# EAGLE board cbm2ram (EAGLE 7.7.0), part 1 of 2
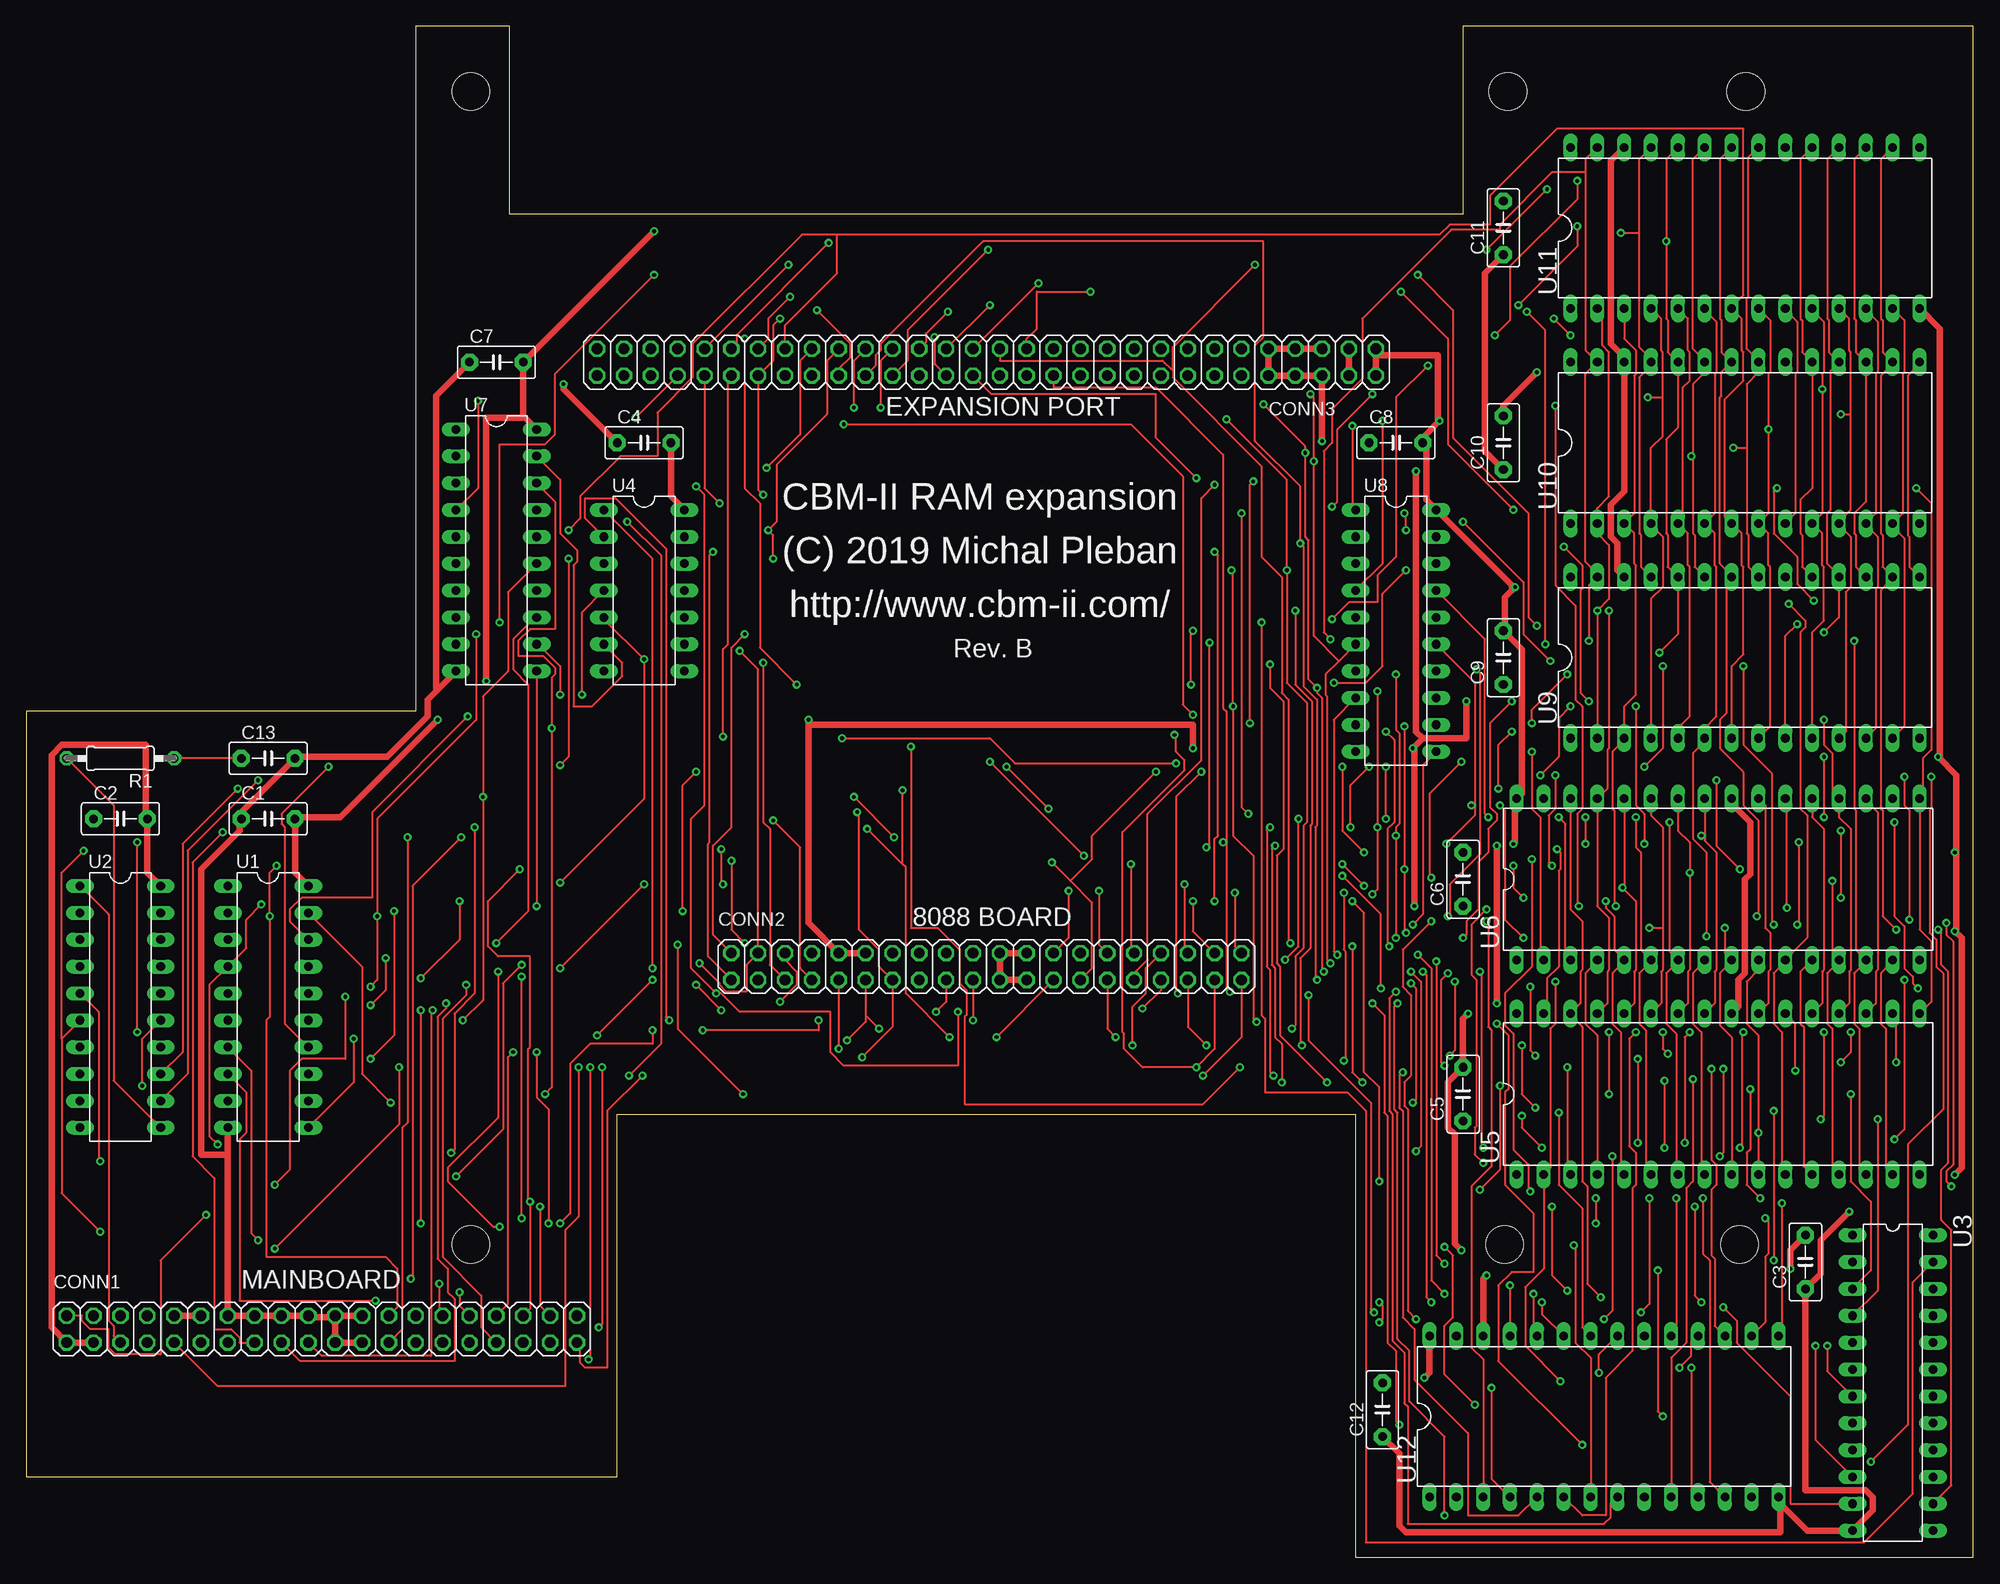
[diagram p1: board, top side]
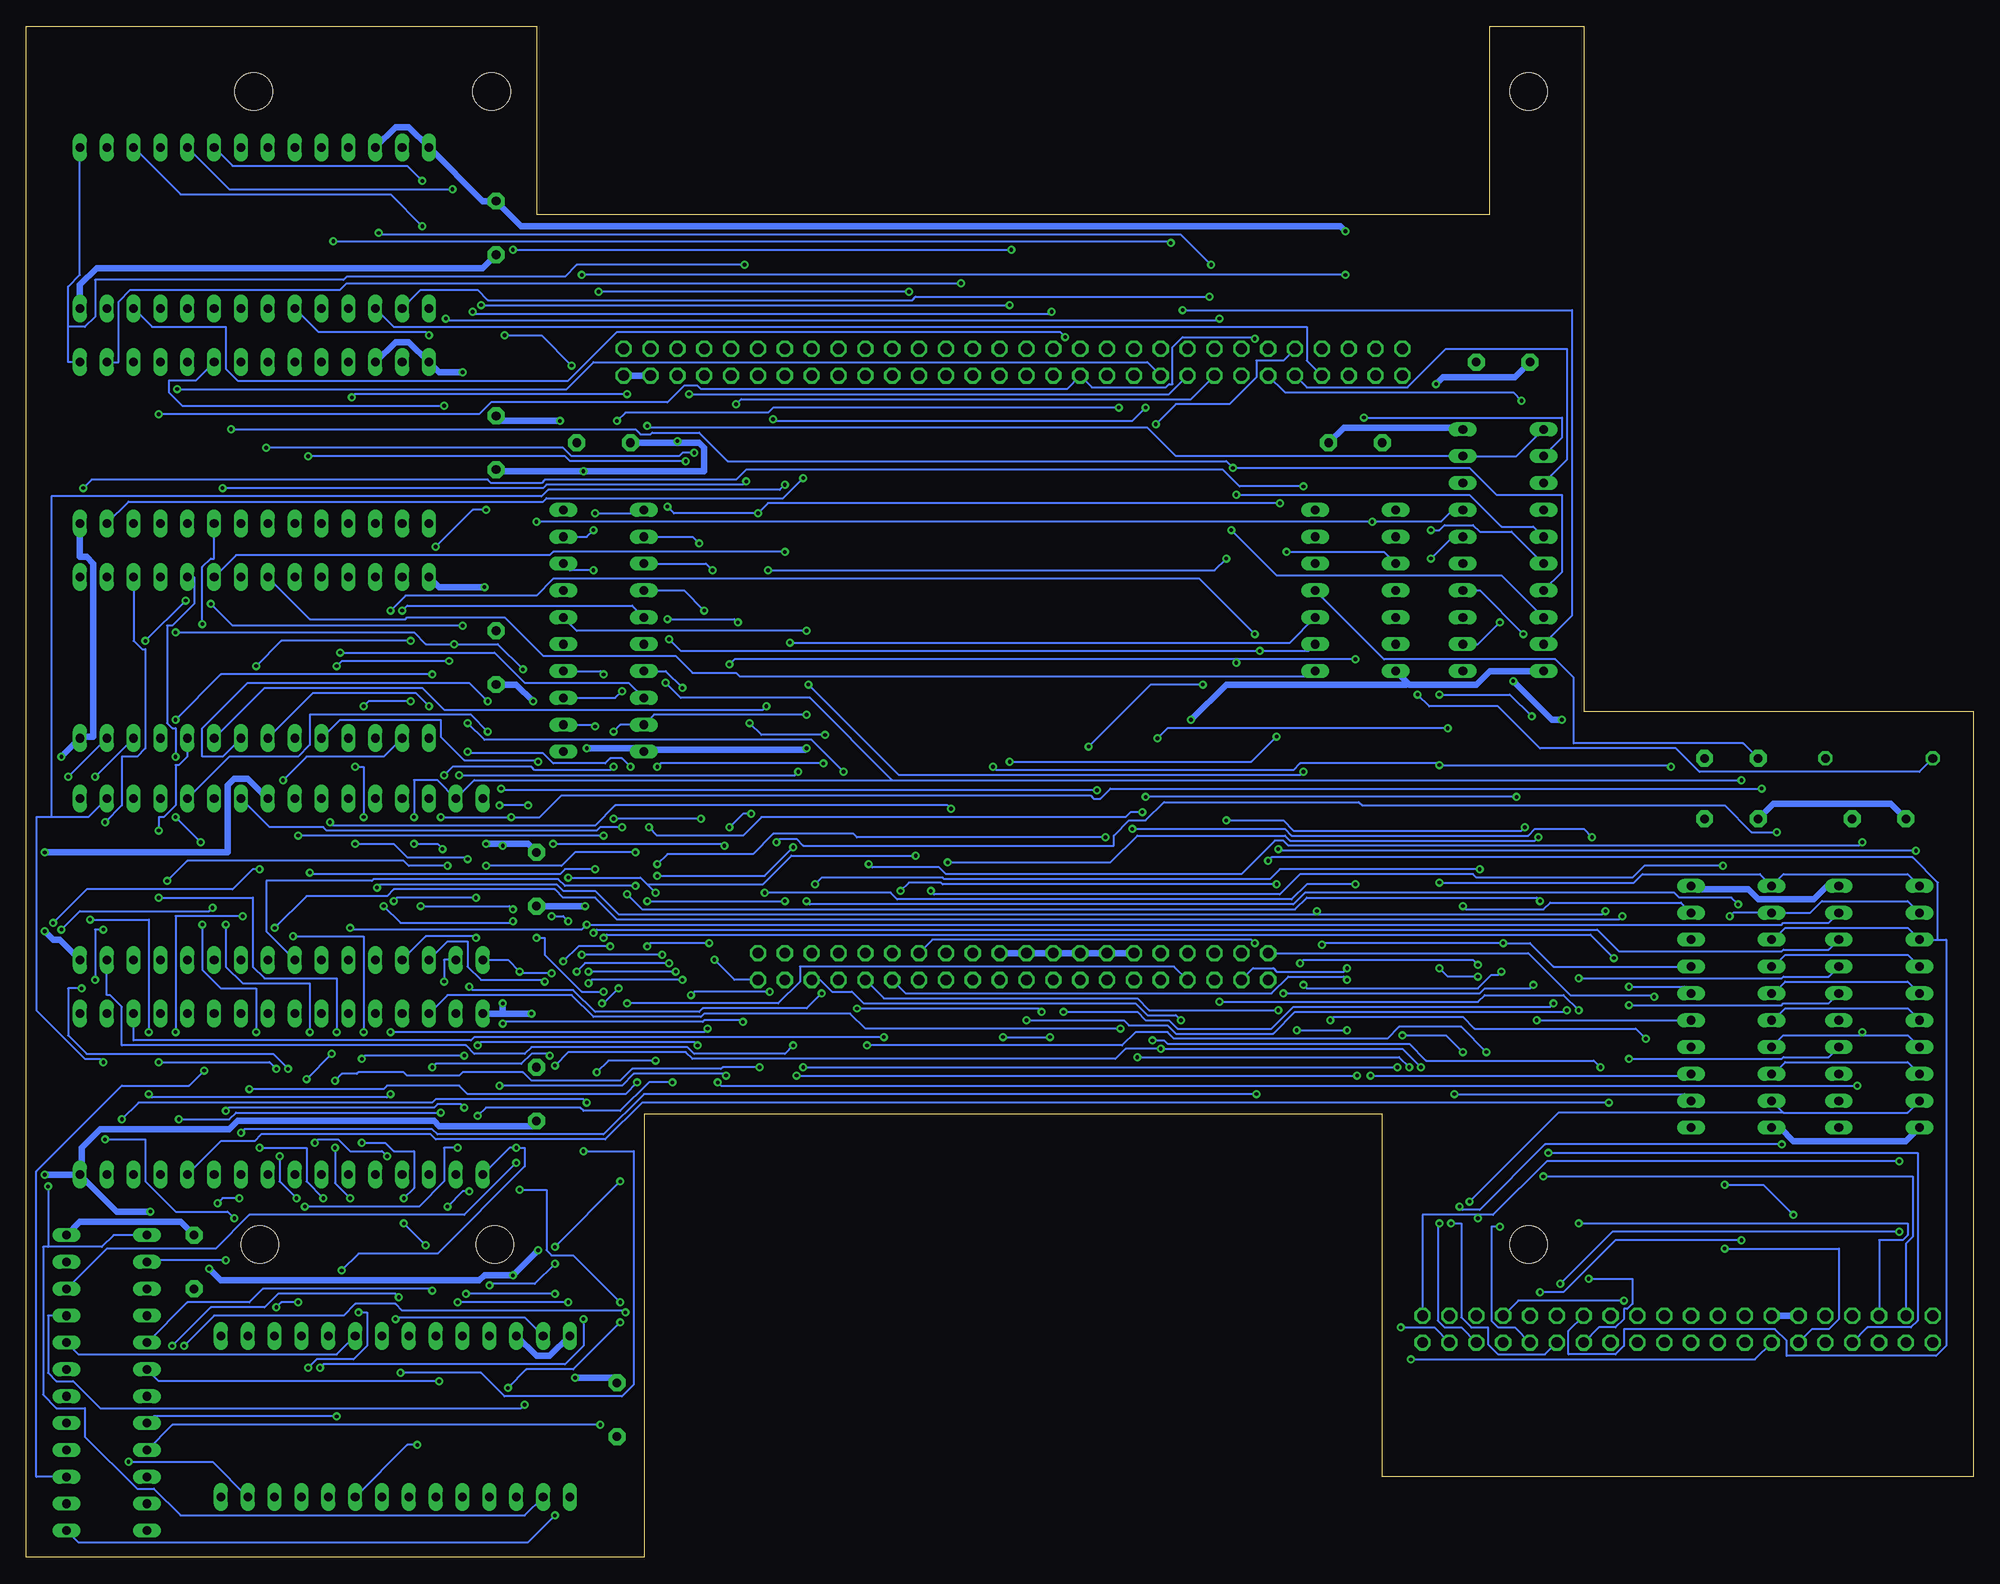
[diagram p2: board, bottom side, seen from below]

Size 184.13 x 144.78 mm. Coordinates in mm from the lower left corner, seen from the top.
Outline: 0,7.62 55.88,7.62 55.88,41.91 125.73,41.91 125.73,0 184.13,0 184.13,144.78 135.89,144.78 135.89,127 45.72,127 45.72,144.78 36.83,144.78 36.83,80.01 0,80.01 0,7.62
Copper layers (1*16): Top 0.035mm / dielectric 1.5mm / Bottom 0.035mm
Design rules "default *": minimum track width 8mil, minimum drill 0.35mm, track to track 8mil, track to pad 8mil, pad to pad 8mil, via to via 8mil, smd to smd 8mil, copper to edge 30mil, drill to drill 8mil, minimum pad ring 10mil, minimum via ring 8mil, stop-mask expansion 4mil, vias tented up to drill 0mil, thermal gap 10mil
Net classes: 0 default: width 0.203 mm, clearance 0.203 mm; 1 power: width 0.635 mm, clearance 0.254 mm to class 0, clearance 0.254 mm
Holes 3.56 mm at 162.05,29.6 139.82,29.6 42.03,29.6 42.03,138.63 140.13,138.63 162.63,138.63
tRestrict: area 20.3,25.4 to 34.9,27.3; area 83.8,59.7 to 98.4,61.6; area 81.3,107.9 to 102.9,109.9; area 71.1,84.5 to 109.2,102.2

## Footprints (pad centres in the part's own frame; a part is rotated, then mirrored left to right if it is on the bottom)
C5B3 = drill 0.813 pad 1.6 octagon: 1 -2.54,0; 2 2.54,0
2X20 = drill 1.016 octagon: 1 -24.13,-1.27; 2 -24.13,1.27; 3 -21.59,-1.27; 4 -21.59,1.27; 5 -19.05,-1.27; 6 -19.05,1.27; 7 -16.51,-1.27; 8 -16.51,1.27; 9 -13.97,-1.27; 10 -13.97,1.27; 11 -11.43,-1.27; 12 -11.43,1.27; 13 -8.89,-1.27; 14 -8.89,1.27; 15 -6.35,-1.27; 16 -6.35,1.27; 17 -3.81,-1.27; 18 -3.81,1.27; 19 -1.27,-1.27; 20 -1.27,1.27; 21 1.27,-1.27; 22 1.27,1.27; 23 3.81,-1.27; 24 3.81,1.27; 25 6.35,-1.27; 26 6.35,1.27; 27 8.89,-1.27; 28 8.89,1.27; 29 11.43,-1.27; 30 11.43,1.27; 31 13.97,-1.27; 32 13.97,1.27; 33 16.51,-1.27; 34 16.51,1.27; 35 19.05,-1.27; 36 19.05,1.27; 37 21.59,-1.27; 38 21.59,1.27; 39 24.13,-1.27; 40 24.13,1.27
2X30 = drill 1.016 octagon: 1 -38.1,-1.27; 2 -38.1,1.27; 3 -35.56,-1.27; 4 -35.56,1.27; 5 -33.02,-1.27; 6 -33.02,1.27; 7 -30.48,-1.27; 8 -30.48,1.27; 9 -27.94,-1.27; 10 -27.94,1.27; 11 -25.4,-1.27; 12 -25.4,1.27; 13 -22.86,-1.27; 14 -22.86,1.27; 15 -20.32,-1.27; 16 -20.32,1.27; 17 -17.78,-1.27; 18 -17.78,1.27; 19 -15.24,-1.27; 20 -15.24,1.27; 21 -12.7,-1.27; 22 -12.7,1.27; 23 -10.16,-1.27; 24 -10.16,1.27; 25 -7.62,-1.27; 26 -7.62,1.27; 27 -5.08,-1.27; 28 -5.08,1.27; 29 -2.54,-1.27; 30 -2.54,1.27; 31 0,-1.27; 32 0,1.27; 33 2.54,-1.27; 34 2.54,1.27; 35 5.08,-1.27; 36 5.08,1.27; 37 7.62,-1.27; 38 7.62,1.27; 39 10.16,-1.27; 40 10.16,1.27; 41 12.7,-1.27; 42 12.7,1.27; 43 15.24,-1.27; 44 15.24,1.27; 45 17.78,-1.27; 46 17.78,1.27; 47 20.32,-1.27; 48 20.32,1.27; 49 22.86,-1.27; 50 22.86,1.27; 51 25.4,-1.27; 52 25.4,1.27; 53 27.94,-1.27; 54 27.94,1.27; 55 30.48,-1.27; 56 30.48,1.27; 57 33.02,-1.27; 58 33.02,1.27; 59 35.56,-1.27; 60 35.56,1.27
0207/10 = drill 0.813 octagon: 1 -5.08,0; 2 5.08,0
DIL20 = drill 0.813 long: 1 -11.43,-3.81; 2 -8.89,-3.81; 3 -6.35,-3.81; 4 -3.81,-3.81; 5 -1.27,-3.81; 6 1.27,-3.81; 7 3.81,-3.81; 8 6.35,-3.81; 9 8.89,-3.81; 10 11.43,-3.81; 11 11.43,3.81; 12 8.89,3.81; 13 6.35,3.81; 14 3.81,3.81; 15 1.27,3.81; 16 -1.27,3.81; 17 -3.81,3.81; 18 -6.35,3.81; 19 -8.89,3.81; 20 -11.43,3.81
DIL24-3 = drill 0.813 long: 1 -13.97,-3.81; 2 -11.43,-3.81; 3 -8.89,-3.81; 4 -6.35,-3.81; 5 -3.81,-3.81; 6 -1.27,-3.81; 7 1.27,-3.81; 8 3.81,-3.81; 9 6.35,-3.81; 10 8.89,-3.81; 11 11.43,-3.81; 12 13.97,-3.81; 13 13.97,3.81; 14 11.43,3.81; 15 8.89,3.81; 16 6.35,3.81; 17 3.81,3.81; 18 1.27,3.81; 19 -1.27,3.81; 20 -3.81,3.81; 21 -6.35,3.81; 22 -8.89,3.81; 23 -11.43,3.81; 24 -13.97,3.81
DIL14 = drill 0.813 long: 1 -7.62,-3.81; 2 -5.08,-3.81; 3 -2.54,-3.81; 4 0,-3.81; 5 2.54,-3.81; 6 5.08,-3.81; 7 7.62,-3.81; 8 7.62,3.81; 9 5.08,3.81; 10 2.54,3.81; 11 0,3.81; 12 -2.54,3.81; 13 -5.08,3.81; 14 -7.62,3.81
DIL32 = drill 0.813 long: 1 -17.78,-7.62; 2 -15.24,-7.62; 3 -12.7,-7.62; 4 -10.16,-7.62; 5 -7.62,-7.62; 6 -5.08,-7.62; 7 -2.54,-7.62; 8 0,-7.62; 9 2.54,-7.62; 10 5.08,-7.62; 11 7.62,-7.62; 12 10.16,-7.62; 13 12.7,-7.62; 14 15.24,-7.62; 15 17.78,-7.62; 16 20.32,-7.62; 17 20.32,7.62; 18 17.78,7.62; 19 15.24,7.62; 20 12.7,7.62; 21 10.16,7.62; 22 7.62,7.62; 23 5.08,7.62; 24 2.54,7.62; 25 0,7.62; 26 -2.54,7.62; 27 -5.08,7.62; 28 -7.62,7.62; 29 -10.16,7.62; 30 -12.7,7.62; 31 -15.24,7.62; 32 -17.78,7.62
DIL28-6 = drill 0.813 long: 1 -16.51,-7.62; 2 -13.97,-7.62; 3 -11.43,-7.62; 4 -8.89,-7.62; 5 -6.35,-7.62; 6 -3.81,-7.62; 7 -1.27,-7.62; 8 1.27,-7.62; 9 3.81,-7.62; 10 6.35,-7.62; 11 8.89,-7.62; 12 11.43,-7.62; 13 13.97,-7.62; 14 16.51,-7.62; 15 16.51,7.62; 16 13.97,7.62; 17 11.43,7.62; 18 8.89,7.62; 19 6.35,7.62; 20 3.81,7.62; 21 1.27,7.62; 22 -1.27,7.62; 23 -3.81,7.62; 24 -6.35,7.62; 25 -8.89,7.62; 26 -11.43,7.62; 27 -13.97,7.62; 28 -16.51,7.62

## Placement (x,y rotation side)
C1  330n  [C5B3]  22.86,69.85 0 top
C2  330n  [C5B3]  8.89,69.85 0 top
C3  330n  [C5B3]  168.28,27.94 90 top
C4  330n  [C5B3]  58.42,105.41 0 top
C5  330n  [C5B3]  135.89,43.81 90 top
C6  330n  [C5B3]  135.89,64.14 90 top
C7  330n  [C5B3]  44.45,113.03 0 top
C8  330n  [C5B3]  129.54,105.41 0 top
C9  330n  [C5B3]  139.7,85.09 90 top
C10  330n  [C5B3]  139.7,105.41 90 top
C11  330n  [C5B3]  139.7,125.73 90 top
C12  330n  [C5B3]  128.27,13.97 90 top
C13  220n  [C5B3]  22.86,75.56 0 top
CONN1  [2X20]  27.94,21.59 180 top
CONN2  [2X20]  90.8,55.88 180 top
CONN3  [2X30]  89.53,113.03 180 top
R1  1k  [0207/10]  8.89,75.56 180 top
U1  74574N  [DIL20]  22.86,52.07 270 top
U2  74574N  [DIL20]  8.89,52.07 270 top
U3  [DIL24-3]  176.53,16.51 270 top
U4  74LS04N  [DIL14]  58.42,91.44 270 top
U5  HM628512A_DIL32  [DIL32]  158.75,43.81 0 top
U6  HM628512A_DIL32  [DIL32]  158.75,64.14 0 top
U7  74541N  [DIL20]  44.45,95.25 270 top
U8  74541N  [DIL20]  129.54,87.63 270 top
U9  [DIL28-6]  162.56,85.09 0 top
U10  [DIL28-6]  162.56,105.41 0 top
U11  [DIL28-6]  162.56,125.73 0 top
U12  [DIL28-6]  149.23,13.33 0 top

## Tracks (layer width: path | path; a pad name or v marks a point on that pad's centre or on a via)
/BUSY1  (via drill 0.35)
  Top 0.203: CONN1.22 27.94,19.05 38.26,19.05 38.26,51.59 v38.42,51.75 | CONN2.22 v89.53,50.8
  Bottom 0.203: v38.42,51.75 38.58,51.59 64.14,51.59 66.2,49.53 75.41,49.53 76.2,50.32 79.85,50.32 80.33,50.8 v89.53,50.8
/BUSY2  (via drill 0.35)
  Top 0.203: CONN1.36 8.25,20.95 8.25,21.91 7.78,22.38 7.78,60.8 U2.1 | U3.11 166.85,5.08 166.85,15.24 161.77,20.32 161.77,22.38 v160.5,23.65 | v158.43,24.13 157.8,24.77 v157.8,33.18 | v143.35,38.73 141.45,40.64 v141.45,41.75 | v123.03,44.93 118.59,49.37 118.59,55.88 118.27,56.2 118.27,66.36 118.9,66.99 118.9,80.96 117.63,82.23 v117.63,84.45 | U4.5 54.61,88.74 v58.42,84.93 58.42,71.75 v50.48,63.82 | CONN2.36 70.33,56.04 70.33,68.9 69.69,69.53 v69.69,84.61
  Bottom 0.203: U2.1 6.19,64.61 17.94,64.61 U1.1 20.16,64.61 31.27,64.61 32.07,63.82 v50.48,63.82 | v160.5,23.65 160.02,24.13 v158.43,24.13 | v157.8,33.18 147,33.18 144.62,35.56 144.62,38.73 v143.35,38.73 | v141.45,41.75 140.65,42.55 131.76,42.55 131.44,42.23 127.95,42.23 125.25,44.93 v123.03,44.93 | v117.63,84.45 117.16,84.93 69.69,84.93 | v58.42,84.93 69.69,84.93 | 69.69,84.93 v69.69,84.61
/CAS  (via drill 0.35)
  Top 0.203: U3.10 169.23,11.11 v169.23,20 | v127.48,23.18 127.16,23.49 127.16,43.02 121.28,48.89 v121.28,53.18 | v113.82,53.5 113.51,53.82 113.51,67.63 | 113.51,67.63 113.51,80.01 113.19,80.33 113.19,104.3 106.84,110.65 97.16,110.65 CONN3.26 | CONN1.26 20.16,20.32 20.16,20.8 19.37,21.59 17.78,21.59 17.78,35.88 15.72,37.94 15.72,65.72 v18.57,68.58 | 113.51,67.63 v113.19,67.63
  Bottom 0.203: v169.23,20 166.37,22.86 154.15,22.86 153.03,23.97 149.23,23.97 148.59,23.34 127.63,23.34 v127.48,23.18 | v121.28,53.18 120.97,53.5 v113.82,53.5 | v18.57,68.58 20.95,68.58 23.5,71.12 57.79,71.12 58.1,71.44 76.52,71.44 78.26,69.69 79.85,69.69 81.28,68.26 81.28,67.31 110.65,67.31 111.28,67.94 112.87,67.94 v113.19,67.63
/CS1  (via drill 0.35)
  Top 0.203: U5.22 167.32,50.48 v167.32,46.04
  Bottom 0.203: v167.32,46.04 168.75,44.61 175.1,44.61 183.2,36.51 183.2,7.62 U3.15
/CS2  (via drill 0.35)
  Top 0.203: U6.22 166.53,71.6 v166.53,61.44 | v180.82,59.37 181.13,59.05 181.13,56.04 181.77,55.4 181.77,37.31 181.13,36.67 181.13,31.91 182.09,30.96 182.09,6.83 U3.14
  Bottom 0.203: v166.53,61.44 166.85,61.12 179.07,61.12 v180.82,59.37
/ECAS  (via drill 0.35)
  Top 0.203: v64.93,95.09 64.61,94.77 64.61,67.63 64.45,67.47 64.45,56.83 CONN2.40
  Bottom 0.203: U4.3 55.72,95.09 v64.93,95.09
/ECAS'  (via drill 0.35)
  Top 0.203: v111.92,86.52 111.92,67.47 v111.6,67.15 | v124.46,64.45 128.11,60.8 v128.11,53.82 | v129.7,52.39 129.38,52.07 129.38,42.39 129.7,42.07 129.7,20.64 130.81,19.53 130.81,14.76 134.14,11.43 v134.14,3.97
  Bottom 0.203: U4.10 64.61,86.52 v111.92,86.52 | v111.6,67.15 114.3,64.45 v124.46,64.45 | v128.11,53.82 129.54,52.39 v129.7,52.39 | v134.14,3.97 136.68,1.43 179.23,1.43 U3.13
/ERAS  (via drill 0.35)
  Top 0.203: U4.1 59.21,94.46 v59.21,55.72
  Bottom 0.203: v59.21,55.72 59.53,55.4 65.88,55.4 66.2,55.72 68.1,55.72 CONN2.38
/OE  (via drill 0.35)
  Top 0.203: U11.22 160.18,132.24 160.18,117.16 160.34,117 160.34,113.98 U10.22 160.34,112.08 160.34,109.85 160.18,109.7 160.18,93.98 161.29,92.87 U9.22 160.81,92.23 160.81,79.85 160.18,79.22 160.18,76.52 162.4,74.3 162.4,71.12 163.83,69.69 163.83,60.8 v163.67,60.64 | U12.22 147.16,21.75 147.16,33.02 144.94,35.24 v144.94,42.07 | v169.7,41.43 170.02,41.75 v170.02,49.69
  Bottom 0.203: U4.8 62.71,83.34 116.68,83.34 117,83.66 121.13,83.66 122.71,85.25 135.25,85.25 138.91,88.9 148.11,88.9 148.27,88.74 157.32,88.74 U9.22 | v144.94,42.07 164.31,42.07 164.94,41.43 v169.7,41.43 | v170.02,49.69 170.02,60.64 v163.67,60.64
/P2REFREQ  (via drill 0.35)
  Top 0.203: CONN1.24 25.88,18.57 40.48,18.57 40.48,24.45 39.85,25.08 39.85,27.3 38.89,28.26 38.89,51.12 39.69,51.91 v39.69,52.39 | v86.04,51.59 86.99,52.55 CONN2.24
  Bottom 0.203: v39.69,52.39 40.01,52.07 64.29,52.07 66.36,50.01 75.25,50.01 76.04,50.8 78.26,50.8 79.06,51.59 v86.04,51.59
/RAM1
  Bottom 0.203: U12.20 154.78,19.21 179.23,19.21 U3.20
/RESET  (via drill 0.35)
  Top 0.203: v37.31,51.75 v37.31,31.59 | v71.28,52.55 72.87,54.13 72.87,55.4 71.75,56.52 CONN2.35
  Bottom 0.203: CONN1.35 8.89,30 6.67,30 6.19,30.48 6.19,31.59 v37.31,31.59 | v37.31,51.75 38.73,53.18 46.2,53.18 46.83,52.55 v71.28,52.55
/ROM1  (via drill 0.35)
  Top 0.203: v112.39,95.09 112.71,94.77 112.71,68.26 112.39,67.94 v112.39,62.07 | v125.41,62.07 126.52,60.96 126.52,45.88 127.95,44.45 v127.95,35.56 | v134.14,29.37 134.94,28.57 134.94,22.7 134.14,21.91 134.14,17.3 v137,14.45
  Bottom 0.203: U9.20 164.31,94.77 134.62,94.77 134.3,95.09 v112.39,95.09 | v125.41,62.07 v112.39,62.07 | v134.14,29.37 v127.95,35.56 | v137,14.45 137.32,14.13 177.17,14.13 179.71,16.67 181.29,16.67 182.09,17.46 182.09,22.86 U3.21
/ROM2  (via drill 0.35)
  Top 0.203: v137.8,37.31 137,38.1 137,40.64 137.16,40.8 137.16,54.61 136.68,55.09 136.68,59.85 v138.11,61.28 | v146.84,61.59 146.69,61.75 146.69,70.33 147.16,70.8 147.16,80.49 146.53,81.12 146.53,90.01 144.62,91.92 v144.62,108.9
  Bottom 0.203: U3.22 176.53,29.21 166.21,29.21 163.04,32.38 142.72,32.38 v137.8,37.31 | v138.11,61.28 138.43,61.59 v146.84,61.59 | v144.62,108.9 169.39,108.9 170.66,110.17 170.66,111.28 168.12,111.28 U10.20
/ROM3  (via drill 0.35)
  Top 0.203: U3.23 178.44,26.04 178.44,6.03 173.83,1.43 126.68,1.43 126.68,42.23 124.94,43.97 117.16,43.97 117.16,50.96 116.84,51.28 v116.84,88.42 | v123.51,88.74 125.09,90.33 127.79,90.33 127.79,92.87 129.54,94.61 129.54,109.7 v132.56,112.71 | v138.91,115.57 140.34,117 140.34,122.08 146.69,128.43 v146.69,130.18
  Bottom 0.203: v116.84,88.42 117.16,88.74 v123.51,88.74 | v132.56,112.71 135.41,115.57 v138.91,115.57 | v146.69,130.18 148.11,131.6 164.62,131.6 U11.20
A0  (via drill 0.35)
  Top 0.203: v74.77,117.95 77.95,114.78 77.95,113.51 76.83,112.39 CONN3.42 | U11.10 168.91,117.95 170.02,116.84 170.02,112.08 169.86,111.92 v169.86,110.49 169.86,98.74 U10.10 169.86,96.84 169.86,93.82 170.02,93.66 170.02,88.58 168.91,87.47 U9.10 | U12.10 155.58,18.89 157,20.32 157,34.92 157.64,35.56 v157.64,45.24 | v155.26,47.62 154.78,48.1 v154.78,49.69 | v171.61,68.74 v171.61,62.39
  Bottom 0.203: U7.9 37.94,89.06 37.94,117.95 v74.77,117.95 | v155.26,47.62 v157.64,45.24 | v154.78,49.69 154.78,54.77 161.61,54.77 162.72,55.88 162.72,62.39 v171.61,62.39 | v171.61,68.74 171.61,70.01 171.13,70.01 170.02,71.12 170.02,74.93 169.7,74.93 168.91,75.72 U9.10 | CONN3.42 78.11,113.03 130.49,113.03 133.03,110.49 v169.86,110.49
A1  (via drill 0.35)
  Top 0.203: CONN3.41 75.72,113.19 75.72,108.11 70.96,103.35 70.96,97.95 v70.17,97.16 70.64,96.68 v70.64,94.46 | U10.9 167.32,98.74 167.32,111.92 167.48,112.08 167.48,116.84 166.37,117.95 U11.9 | v147.16,10.64 139.22,18.57 139.22,25.72 140.49,26.99 142.56,26.99 142.56,32.54 139.86,35.24 139.86,43.97 140.18,44.29 140.18,49.37 v139.06,50.48 | v116.36,50.64 116.05,50.96 116.05,66.36 114.14,68.26 v114.14,80.49 114.14,93.19 v113.98,93.34 | v167.48,88.27 166.37,87.15 U9.9
  Bottom 0.203: U7.8 44.61,92.87 65.88,92.87 v70.17,97.16 | U12.9 148.11,10.64 v147.16,10.64 | v139.06,50.48 138.91,50.64 120.17,50.64 120.02,50.8 116.52,50.8 v116.36,50.64 | v114.14,80.49 114.46,80.17 144.62,80.17 146.69,82.23 161.61,82.23 U9.9 | U10.9 166.37,94.46 166.69,94.46 167.48,93.66 v167.48,88.27 | v70.64,94.46 71.75,93.34 v113.98,93.34
A2  (via drill 0.35)
  Top 0.203: v70.01,103.03 73.18,106.2 73.18,113.19 CONN3.43 | U11.8 164.94,117 164.94,112.08 164.78,111.92 v164.78,106.68 164.78,98.74 U10.8 164.78,96.84 164.78,93.82 164.94,93.66 164.94,78.58 U9.8 | U12.8 149.86,5.08 149.86,3.81 149.23,3.18 130.65,3.18 130.65,14.29 130.33,14.6 130.33,19.37 129.22,20.48 129.22,41.91 128.91,42.23 128.91,52.86 v129.54,53.5 | v135.89,58.58 136.21,58.9 136.21,60.17 137.32,61.28 137.32,65.72 138.27,66.67 138.27,68.9 139.06,69.69 139.06,70.33 138.43,70.96 138.43,78.9 v140.49,80.96
  Bottom 0.203: U7.7 38.89,93.19 38.89,100.49 45.09,100.49 47.62,103.03 v70.01,103.03 70.64,103.66 117.79,103.66 120.49,106.36 124.94,106.36 125.09,106.2 126.05,106.2 126.52,106.68 v164.78,106.68 | v129.54,53.5 131.6,53.5 135.1,56.99 135.1,58.58 v135.89,58.58 | v140.49,80.96 142.24,82.71 163.2,82.71 167.48,78.42 167.48,75.72 165.58,75.72 U9.8
A3  (via drill 0.35)
  Top 0.203: v51.28,97.16 52.39,98.27 52.39,100.33 56.2,104.14 59.69,104.14 59.69,108.27 63.02,111.6 63.02,114.78 73.34,125.09 76.68,125.09 | 76.68,125.09 76.68,121.44 71.75,116.52 CONN3.45 | U12.7 147.96,18.89 146.53,20.32 146.53,29.37 v146.37,29.53 | v148.43,33.97 v148.43,31.59 | v152.4,47.15 v152.4,39.21 | v142.72,47.47 142.24,47.94 v142.24,53.97 | v108.9,53.34 108.74,53.5 108.74,71.91 v111.12,74.3 | v143.19,73.98 144.94,75.72 144.94,79.38 v146.05,80.49 | U9.7 161.29,84.3 162.4,85.41 162.4,93.66 162.24,93.82 162.24,96.84 U10.7 160.66,98.42 160.66,109.54 162.4,111.28 162.4,113.98 162.24,114.14 162.24,117.16 U11.7 161.29,118.27 162.4,119.38 162.4,135.1 144.78,135.1 138.43,128.75 138.43,126.05 134.62,126.05 133.67,125.09 76.68,125.09
  Bottom 0.203: U7.6 43.66,97 46.67,97 47.31,97.63 50.01,97.63 50.48,97.16 v51.28,97.16 | v148.43,31.59 v146.37,29.53 | v148.43,33.97 147.48,34.92 147.48,38.42 149.38,38.42 150.18,39.21 v152.4,39.21 | v152.4,47.15 152.08,47.47 v142.72,47.47 | v142.24,53.97 141.92,53.66 132.4,53.66 130.33,51.59 120.49,51.59 120.17,51.91 110.33,51.91 v108.9,53.34 | v111.12,74.3 111.44,73.98 v143.19,73.98 | v146.05,80.49 147.32,81.76 157,81.76 U9.7
A4  (via drill 0.35)
  Top 0.203: v69.69,100.49 69.22,100.96 CONN3.48 70.64,113.19 70.64,116.52 v71.28,117.16 | U11.6 158.75,117.95 159.86,116.84 159.86,112.08 159.7,111.92 159.7,98.74 U10.6 159.7,96.84 159.7,93.82 159.86,93.66 159.86,79.53 158.75,78.42 U9.6 158.75,77.15 157.64,76.04 157.64,67.94 158.91,66.67 v158.91,58.74 | U12.6 147.16,3.97 149.38,3.97 149.38,16.99 151.92,19.53 151.92,34.92 152.24,35.24 152.24,38.26 151.61,38.89 151.61,49.05 v152.24,49.69 | v146.05,115.57 v144.46,117.16
  Bottom 0.203: U7.5 41.59,97.47 44.61,97.47 47.62,100.49 v69.69,100.49 | v152.24,49.69 152.24,58.74 v158.91,58.74 | v71.28,117.16 71.44,117 144.3,117 v144.46,117.16 | v146.05,115.57 146.37,115.89 156.53,115.89 U11.6
A5  (via drill 0.35)
  Top 0.203: U7.4 42.7,101.12 v42.7,109.38 | U12.5 141.13,3.97 136.37,3.97 136.37,11.75 131.29,16.83 131.29,21.59 130.18,22.7 130.18,42.23 129.86,42.55 129.86,45.56 v130.18,45.88 | v124.62,46.99 124.78,47.15 124.78,57.31 124.62,57.47 v124.62,62.86 | v132.87,64.29 132.72,64.45 132.72,72.23 v135.73,75.25 | 156.69,97.31 157.16,96.84 157.16,93.82 157.32,93.66 157.32,79.53 156.21,78.42 U9.5 | U11.5 157.16,117.16 157.16,114.14 157.32,113.98 157.32,111.28 156.69,110.65 156.69,97.31 | 156.69,97.31 U10.5 | CONN3.50 66.36,111.44 66.36,86.36 65.88,85.88 v65.88,77.63 | v100.01,66.36 v91.12,75.25
  Bottom 0.203: v42.7,109.38 43.5,110.17 65.09,110.17 CONN3.50 | v130.18,45.88 129.06,46.99 v124.62,46.99 | 125.41,63.66 126.05,64.29 v132.87,64.29 | 125.41,63.66 v124.62,62.86 | v135.73,75.25 135.89,75.41 142.72,75.41 144.94,77.63 144.94,79.22 154.46,79.22 U9.5 | v65.88,77.63 68.26,75.25 v91.12,75.25 | v100.01,66.36 111.76,66.36 114.46,63.66 125.41,63.66
A6  (via drill 0.35)
  Top 0.203: U9.4 153.67,90.65 154.78,91.76 154.78,96.52 153.67,97.63 U10.4 153.67,104.93 154.78,106.05 154.78,109.7 | U11.4 154.62,117.16 154.62,114.14 154.78,113.98 154.78,109.7 | U12.4 138.59,7.46 v138.59,16.03 | v127.95,22.22 128.27,22.54 128.27,23.81 v127.95,24.13 | v137.48,34.77 139.38,36.67 v139.38,44.61 | v117.95,45.56 117.63,45.88 117.63,55.56 117.32,55.88 117.32,68.74 v117.63,69.06 | v115.57,70.33 114.93,70.96 v114.93,98.74 | v65.56,99.69 64.14,101.12 CONN3.52 | v153.35,109.7 154.78,109.7 | v127.32,110.01 123.98,106.68 123.98,99.85 v123.51,99.38
  Bottom 0.203: U7.3 38.42,103.82 38.42,114.3 49.85,114.3 53.5,110.65 63.02,110.65 CONN3.52 | v138.59,16.03 136.84,17.78 132.4,17.78 v127.95,22.22 | v127.95,24.13 132.4,28.57 134.46,28.57 134.94,29.05 134.94,34.77 v137.48,34.77 | v139.38,44.61 127.79,44.61 126.68,45.72 118.11,45.72 v117.95,45.56 | v117.63,69.06 116.36,70.33 v115.57,70.33 | v65.56,99.69 113.98,99.69 v114.93,98.74 122.87,98.74 v123.51,99.38 | v153.35,109.7 153.03,110.01 v127.32,110.01
A7  (via drill 0.35)
  Top 0.203: CONN3.54 v57.63,107.79 | U11.3 151.13,115.25 152.24,114.14 152.24,111.92 152.08,111.76 152.08,98.74 U10.3 152.08,96.84 152.08,93.98 152.24,93.82 152.24,81.6 151.13,80.49 U9.3 151.13,77.31 150.02,76.2 150.02,70.8 150.18,70.64 150.18,61.75 v150.34,61.59 | U12.3 137.8,18.73 136.68,19.84 136.68,35.08 138.59,36.99 138.59,49.85 138.27,50.16 138.27,60.01 v138.11,60.17
  Bottom 0.203: U7.2 38.89,105.89 38.89,107.79 v57.63,107.79 | v138.11,60.17 138.27,60.01 148.75,60.01 v150.34,61.59 | CONN3.54 63.02,113.19 63.02,116.36 149.38,116.36 U11.3
A8  (via drill 0.35)
  Top 0.203: U9.25 152.72,93.66 152.72,96.68 152.56,96.84 152.56,111.6 153.67,112.71 U10.25 153.67,113.35 152.56,114.46 152.56,125.25 | U11.25 152.56,132.24 152.56,125.25 | v110.33,79.69 109.38,80.64 109.38,102.23 104.46,107.16 v77.31,107.16 | v140.34,25.72 U12.25 | v134.14,27.78 133.35,28.57 v133.35,56.36 | v128.91,57.78 128.75,57.94 128.75,68.9 129.38,69.53 129.38,77.31 v128.59,78.11 | v150.81,125.25 152.56,125.25 | CONN3.51 v72.07,122.24
  Bottom 0.203: v110.33,79.69 124.78,79.69 U8.9 127.95,78.74 v128.59,78.11 | v77.31,107.16 75.41,109.06 70.33,109.06 67.79,111.6 67.79,113.19 65.25,113.19 CONN3.51 | v140.34,25.72 140.18,25.88 136.05,25.88 v134.14,27.78 | v133.35,56.36 131.92,57.78 v128.91,57.78 | v150.81,125.25 150.65,125.09 74.93,125.09 v72.07,122.24
A9  (via drill 0.35)
  Top 0.203: v154.46,85.57 156.21,87.31 U9.24 155.26,93.66 155.26,96.68 155.1,96.84 155.1,105.73 156.21,106.84 U10.24 155.26,113.98 155.26,117 155.1,117.16 v155.1,124.46 155.1,132.24 U11.24 | U12.24 142.56,21.27 v142.56,24.92 | v134.14,24.92 132.87,26.19 132.87,55.72 v131.6,56.99 | v123.98,56.99 123.67,57.31 123.67,79.22 U8.8 | CONN3.49 67.15,114.78 67.15,115.57 v75.88,124.3
  Bottom 0.203: U8.8 127.16,82.71 137,82.71 139.86,85.57 v154.46,85.57 | v134.14,24.92 v142.56,24.92 | v123.98,56.99 v131.6,56.99 | v75.88,124.3 76.04,124.46 v155.1,124.46
A10  (via drill 0.35)
  Top 0.203: U9.21 162.88,93.66 162.88,96.68 162.72,96.84 162.72,104.93 | 162.72,104.93 162.72,110.97 163.83,112.08 U10.21 163.83,113.19 162.72,114.3 162.72,119.06 162.88,119.22 162.88,132.4 U11.21 | U12.21 148.75,19.21 v148.75,17.46 | v131.44,38.42 131.92,38.89 131.92,54.45 v130.97,55.4 | v122.71,55.4 122.55,55.56 122.55,81.28 122.08,81.76 v122.08,82.23 121.28,83.03 121.28,96.2 120.97,96.52 v120.97,104.46 120.97,105.09 v117,109.06 | v161.45,104.93 162.72,104.93
  Bottom 0.203: v148.75,17.46 141.13,17.46 138.91,15.24 127.79,15.24 126.68,16.35 126.68,38.42 v131.44,38.42 | v122.71,55.4 v130.97,55.4 | v122.08,82.23 123.67,83.82 U8.7 | CONN3.46 73.98,109.54 116.52,109.54 v117,109.06 | v161.45,104.93 133.35,104.93 132.56,104.14 122.4,104.14 122.08,104.46 v120.97,104.46
A11  (via drill 0.35)
  Top 0.203: U9.23 157.8,93.66 157.8,96.68 157.64,96.84 157.64,104.14 | 157.64,104.14 157.64,110.97 158.75,112.08 U10.23 158.75,113.19 157.64,114.3 157.64,132.24 U11.23 | U12.23 143.35,23.02 v143.35,24.13 | v132.87,24.13 132.4,24.61 132.4,55.09 v132.08,55.4 | v123.35,56.2 123.03,56.52 123.03,81.44 122.87,81.6 122.87,83.5 124.14,84.77 | U8.6 124.14,84.77 | v121.44,110.01 121.76,109.7 v121.76,103.66 121.76,87.15 124.14,84.77 | v157.48,104.14 157.64,104.14
  Bottom 0.203: v132.87,24.13 v143.35,24.13 | v132.08,55.4 131.29,56.2 v123.35,56.2 | CONN3.44 76.04,110.01 v121.44,110.01 | v157.48,104.14 133.19,104.14 132.72,103.66 v121.76,103.66
A12  (via drill 0.35)
  Top 0.203: U9.2 v148.59,89.53 149.7,90.65 149.7,95.73 148.59,96.84 U10.2 148.59,99.22 149.7,100.33 149.7,113.98 149.07,114.62 149.07,117.63 U11.2 | CONN3.47 70.17,115.25 70.17,117.16 v72.23,119.22 | v182.09,35.08 181.61,35.56 181.61,36.51 182.25,37.15 182.25,58.26 181.61,58.9 v181.61,60.01 | v162.08,65.09 159.86,67.31 v159.86,73.5
  Bottom 0.203: U12.2 137,3.97 169.55,3.97 172.09,6.51 173.67,6.51 178.59,11.43 178.59,14.13 181.29,14.13 182.56,15.4 182.56,29.37 182.09,29.37 | 182.09,29.37 177.01,29.37 175.9,30.48 U3.1 | U8.5 126.84,90.01 148.11,90.01 v148.59,89.53 | v72.23,119.22 100.01,119.22 100.33,118.9 140.49,118.9 141.45,119.86 146.84,119.86 U11.2 | v182.09,35.08 182.09,29.37 | v181.61,60.01 178.44,63.18 164.62,63.18 162.72,65.09 v162.08,65.09 | v159.86,73.5 157.64,75.72 150.34,75.72 U9.2
A13  (via drill 0.35)
  Top 0.203: U8.4 128.27,93.98 v128.27,107.47 | v80.8,108.74 80.8,113.19 CONN3.37 | v165.26,42.23 v165.26,28.1 | v142.72,42.55 141.45,43.81 v141.45,48.42 | v120.65,48.42 120.49,48.58 120.49,56.67 121.44,57.63 121.44,69.22 121.6,69.37 121.6,80.96 120.02,82.55 v120.02,89.53
  Bottom 0.203: v128.27,107.47 127.48,108.27 113.98,108.27 113.51,108.74 v80.8,108.74 | U3.2 172.56,28.1 v165.26,28.1 | v165.26,42.23 164.94,42.55 145.57,42.55 145.26,42.86 143.03,42.86 v142.72,42.55 | v141.45,48.42 141.13,48.74 120.97,48.74 v120.65,48.42 | v120.02,89.53 121.92,91.44 U8.4
A14  (via drill 0.35)
  Top 0.203: U3.3 174.47,27.15 174.47,33.66 172.56,35.56 v172.56,43.81 | v149.7,49.69 v149.7,43.81 | v119.7,50.01 120.02,50.32 120.02,56.83 120.81,57.63 120.81,69.22 121.13,69.53 121.13,80.8 119.22,82.71 v119.22,93.34 119.22,101.92 v113.51,107.63 | CONN3.39 78.26,113.19 v78.26,108.74
  Bottom 0.203: v172.56,43.81 172.24,43.5 150.02,43.5 v149.7,43.81 | v149.7,49.69 120.02,49.69 v119.7,50.01 | v119.22,93.34 119.86,93.98 U8.3 | v78.26,108.74 79.53,107.47 113.35,107.47 v113.51,107.63
A15  (via drill 0.35)
  Top 0.203: U3.4 175.1,25.24 v175.1,41.43 | v131.13,43.02 131.44,43.34 131.44,53.82 v130.97,54.29 | v122.08,54.61 121.92,54.77 121.92,69.06 122.08,69.22 122.08,81.12 120.81,82.39 120.81,95.57 v120.49,95.88 120.49,101.28 116.2,105.57 116.2,114.62 117,115.41 117,124.46 90.49,124.46 80.8,114.78 80.8,114.14 80.33,113.66 80.33,112.71 CONN3.40
  Bottom 0.203: v175.1,41.43 173.51,43.02 145.73,43.02 145.42,43.34 131.44,43.34 v131.13,43.02 | v130.97,54.29 130.65,54.61 v122.08,54.61 | v120.49,95.88 121.13,96.52 U8.2
BP0  (via drill 0.35)
  Top 0.203: v144.62,54.45 144.62,50.48 144.15,50.01 144.15,36.83 U5.2 143.51,27.3 141.76,25.56 141.76,20 v145.1,16.67 | v53.18,18.73 53.34,18.89 v53.34,46.36 | v79.06,47.31 81.91,50.16 CONN2.28 80.64,55.88 80.64,57.47 78.74,59.37 78.74,70.33 v78.58,70.48 | U6.2 143.19,56.83 143.19,70.01 142.4,70.8 v142.4,76.2 | v127,74.77 125.25,73.03 v125.25,69.06
  Bottom 0.203: v144.62,54.45 144.62,56.52 U6.2 | U3.6 171.61,16.67 v145.1,16.67 | CONN1.28 20.64,18.73 v53.18,18.73 | v53.34,46.36 54.29,47.31 v79.06,47.31 | v142.4,76.2 142.24,76.04 135.25,76.04 134.3,75.09 129.38,75.09 128.91,75.56 127.79,75.56 v127,74.77 | v125.25,69.06 124.46,68.26 116.36,68.26 114.62,70.01 80.17,70.01 79.69,70.48 v78.58,70.48
BP1  (via drill 0.35)
  Top 0.203: U6.30 146.05,61.28 147.16,60.17 147.16,55.56 147,55.4 147,52.39 U5.30 146.05,51.28 147.16,50.16 147.16,35.56 147.64,35.08 147.64,25.88 v148.91,24.61 | U3.7 170.34,17.62 v170.34,20 | v23.5,29.21 35.24,40.96 v35.24,46.36 | v77.63,48.89 79.38,50.64 79.38,51.28 | CONN2.30 79.38,51.28 | 79.38,51.28 v80.64,50.01
  Bottom 0.203: v170.34,20 166.69,23.65 161.61,23.65 160.34,24.92 149.23,24.92 v148.91,24.61 | CONN1.30 15.24,21.59 13.65,21.59 12.7,22.54 12.7,29.21 v23.5,29.21 | v35.24,46.36 35.88,46.99 51.75,46.99 53.34,48.58 76.2,48.58 76.52,48.89 v77.63,48.89 | U5.30 144.3,53.18 132.56,53.18 130.49,51.12 120.33,51.12 120.02,51.44 106.2,51.44 104.77,50.01 v80.64,50.01
BP2  (via drill 0.35)
  Top 0.203: v137.8,38.73 137.64,38.89 137.64,55.24 v137.48,55.4 | v154.78,13.33 154.31,13.81 v154.31,27.15 | CONN1.32 18.1,16.19 50.96,16.19 50.96,30.96 52.23,32.23 v52.23,46.36 | CONN2.32 v76.83,48.1 | v134.46,55.24 133.83,54.61 133.83,46.83 v134.14,46.51
  Bottom 0.203: U5.1 138.43,38.73 v137.8,38.73 137,38.73 137,36.99 145.26,28.73 152.72,28.73 v154.31,27.15 | U6.1 138.59,56.52 v137.48,55.4 137.32,55.24 v134.46,55.24 | U3.8 172.09,13.33 v154.78,13.33 | v52.23,46.36 53.98,48.1 v76.83,48.1 80.17,48.1 81.12,47.15 121.13,47.15 121.76,47.78 132.87,47.78 v134.14,46.51
BP3  (via drill 0.35)
  Top 0.203: v129.86,12.54 129.54,12.86 129.54,19.53 128.75,20.32 128.75,41.75 128.43,42.07 128.43,51.28 v127.32,52.39 | v40.16,38.26 40.48,38.58 40.48,51.44 42.39,53.34 v42.39,69.06 | v70.64,69.69 73.18,67.15 73.18,55.72 CONN2.34
  Bottom 0.203: U3.9 170.34,12.54 v129.86,12.54 | v127.32,52.39 113.03,52.39 110.97,54.45 110.97,55.88 75.56,55.88 CONN2.34 | CONN1.34 10,21.75 5.87,21.75 5.24,22.38 5.24,38.26 v40.16,38.26 | v42.39,69.06 42.7,68.74 64.29,68.74 65.25,69.69 v70.64,69.69
BUSY2  (via drill 0.35)
  Top 0.203: v130.33,98.74 130.49,98.58 v130.49,97.16 | U4.6 56.36,84.61 56.36,83.34 53.5,80.49 51.75,80.49 51.75,93.82 52.07,94.14 52.07,95.25 50.48,96.84 50.48,101.92 U7.19 | U8.1 125.41,99.38 v125.41,107
  Bottom 0.203: U8.1 126.05,98.74 v130.33,98.74 | v130.49,97.16 131.13,96.52 U8.19 | U7.1 43.18,104.14 U7.19 75.41,104.14 78.11,106.84 125.25,106.84 v125.41,107
D0  (via drill 0.35)
  Top 0.203: U5.13 170.81,36.83 170.81,50.01 170.34,50.48 170.34,55.24 171.45,56.36 U6.13 170.81,57.15 v170.81,63.98 | CONN1.2 52.39,20 52.39,18.41 52.86,17.94 54.93,17.94 54.93,42.23 v58.26,45.56 | v111.28,45.56 114.93,49.21 CONN2.2 | v144.3,65.41 143.99,65.72 143.99,70.17 144.62,70.8 v144.62,73.98 | v128.59,69.85 v128.59,74.77 | v120.33,69.85 120.33,57.78 v119.06,56.52
  Bottom 0.203: v111.28,45.56 v58.26,45.56 | v170.81,63.98 168.91,65.88 148.43,65.88 147.96,65.41 v144.3,65.41 | v144.62,73.98 143.83,74.77 136.37,74.77 136.05,74.45 128.91,74.45 v128.59,74.77 | v120.33,69.85 v128.59,69.85 | v119.06,56.52 117.16,54.61 CONN2.2
D1  (via drill 0.35)
  Top 0.203: U5.14 173.36,36.83 173.36,50.01 172.88,50.48 172.88,55.24 173.99,56.36 U6.14 173.04,57.47 173.04,70.64 172.88,70.8 v172.88,86.68 | v54.13,21.75 54.45,22.07 v54.45,46.36 | CONN2.4 112.39,48.1 v110.65,46.36 105.57,46.36 103.82,48.1 103.82,49.53 103.66,49.69 103.66,68.58 109.54,74.45 109.54,75.41 108.74,76.2 108.74,77.63 v108.58,77.79 | v169.07,90.49 167.48,92.07 167.48,94.61 165.26,96.84 165.26,100.81 v165.58,101.12 | v116.05,101.76 115.73,101.44 v115.73,78.9
  Bottom 0.203: CONN1.4 50.96,21.75 v54.13,21.75 | v110.65,46.36 v54.45,46.36 | v169.07,90.49 v172.88,86.68 | v165.58,101.12 135.25,101.12 134.94,101.44 116.36,101.44 v116.05,101.76 | v115.73,78.9 114.62,77.79 v108.58,77.79
D2  (via drill 0.35)
  Top 0.203: U5.15 175.9,36.83 175.9,50.01 175.42,50.48 175.42,55.24 176.53,56.36 U6.15 | v50.48,31.59 51.44,32.54 51.44,46.67 53.34,48.58 59.21,48.58 v59.21,49.85 | v63.98,49.85 74.93,49.85 v74.93,50.8 | v111.6,48.42 109.85,50.16 CONN2.6
  Bottom 0.203: CONN1.6 48.42,21.75 50.01,21.75 50.64,22.38 50.64,31.59 v50.48,31.59 | v63.98,49.85 v59.21,49.85 | v74.93,50.8 75.41,51.28 78.11,51.28 79.22,52.39 104.93,52.39 106.05,53.5 107.95,53.5 109.06,54.61 CONN2.6 | U6.15 176.53,53.18 176.21,53.18 175.1,52.07 175.1,48.42 142.56,48.42 141.76,47.62 137,47.62 136.37,48.26 121.6,48.26 120.97,47.62 112.39,47.62 v111.6,48.42
D3  (via drill 0.35)
  Top 0.203: U5.17 180.18,52.55 180.18,58.26 179.07,59.37 U6.17 179.39,72.07 179.39,75.56 180.18,76.36 180.18,99.69 v178.75,101.12 | CONN1.8 43.02,21.75 43.02,24.77 39.37,28.42 39.37,50.96 41.59,53.18 v41.59,54.13 | v88.11,51.59 88.11,46.51 77.31,46.51 76.04,47.78 76.04,51.59 67.47,51.59 65.72,53.34 v65.25,53.34 62.87,55.72 62.87,69.85 64.14,71.12 64.14,100.49 v63.34,101.28 | v105.57,51.91 107.31,53.66 CONN2.8
  Bottom 0.203: v41.59,54.13 41.91,53.82 46.2,53.82 46.67,53.34 v65.25,53.34 | v88.11,51.59 88.42,51.91 v105.57,51.91 | v178.75,101.12 177.96,101.92 140.49,101.92 140.18,101.6 135.41,101.6 135.1,101.92 117,101.92 116.05,102.87 70.96,102.87 69.37,101.28 v63.34,101.28
D4  (via drill 0.35)
  Top 0.203: U5.18 176.85,51.12 v176.85,46.83 | v44.77,31.27 44.13,31.27 39.85,35.56 39.85,36.83 44.61,41.59 v44.61,55.4 | v65.72,51.75 v63.34,54.13 | v112.39,101.44 111.12,100.17 111.12,75.41 106.05,70.33 106.05,56.52 104.77,55.24 CONN2.10
  Bottom 0.203: v176.85,46.83 177.17,47.15 178.59,47.15 183.2,51.75 183.2,70.01 181.77,70.01 | 181.77,70.01 178.28,70.01 U6.18 | CONN1.10 43.34,21.75 44.93,21.75 45.56,22.38 45.56,31.27 v44.77,31.27 | v44.61,55.4 44.93,55.09 45.56,55.09 46.83,53.82 63.02,53.82 v63.34,54.13 | v65.72,51.75 77.95,51.75 79.06,52.86 103.03,52.86 CONN2.10 | 181.77,70.01 181.77,100.33 135.41,100.33 134.78,100.96 112.87,100.96 v112.39,101.44
D5  (via drill 0.35)
  Top 0.203: U5.19 174.94,52.39 174.94,55.4 175.1,55.56 175.1,70.48 173.99,71.6 U6.19 | v49.37,31.59 49.37,42.39 48.26,43.5 v48.26,47.78 | v59.21,54.61 v53.98,49.37 | v103.03,49.21 102.23,50.01 CONN2.12
  Bottom 0.203: CONN1.12 40.48,19.21 44.93,19.21 45.88,20.16 45.88,21.75 47.47,21.75 48.42,22.7 48.42,31.59 v49.37,31.59 | v48.26,47.78 49.85,49.37 v53.98,49.37 | v59.21,54.61 59.53,54.93 64.77,54.93 66.36,53.34 100.96,53.34 CONN2.12 | U5.19 173.99,48.89 142.08,48.89 141.76,49.21 v103.03,49.21
D6  (via drill 0.35)
  Top 0.203: U5.20 172.4,52.39 172.4,55.4 172.56,55.56 172.56,68.9 171.45,70.01 U6.20 170.81,72.39 170.81,76.04 170.02,76.83 v170.02,79.22 | v36.35,26.35 36.51,26.51 36.51,63.5 v41.12,68.1 | 98.74,63.98 100.81,61.91 100.81,55.72 CONN2.14 | 98.74,63.98 v97,65.72 | v145.73,83.5 142.4,80.17 v142.4,78.9 | v106.84,74.3 100.81,68.26 100.81,66.04 98.74,63.98
  Bottom 0.203: CONN1.14 35.4,21.75 33.81,21.75 33.02,22.54 33.02,23.49 32.7,23.49 32.23,23.97 32.23,26.35 v36.35,26.35 | v41.12,68.1 41.43,67.79 64.61,67.79 65.09,68.26 79.06,68.26 81.6,65.72 v97,65.72 | v170.02,79.22 165.74,83.5 v145.73,83.5 | v142.4,78.9 140.81,77.31 109.85,77.31 v106.84,74.3
D7  (via drill 0.35)
  Top 0.203: U5.21 169.86,52.39 169.86,55.4 170.02,55.56 170.02,68.9 168.91,70.01 U6.21 | CONN1.16 35.56,21.59 35.56,40.64 36.04,41.12 v36.04,68.1 | 82.87,65.56 83.18,65.25 83.18,53.34 v87.31,49.21 | 82.87,65.56 v79.53,68.9 | CONN2.16 v91.76,49.21 | v140.49,78.11 139.22,76.83 v139.22,72.71 | 82.87,65.56 v82.87,72.55
  Bottom 0.203: v36.04,68.1 36.83,68.9 41.43,68.9 42.07,68.26 64.45,68.26 65.09,68.9 v79.53,68.9 | v91.76,49.21 v87.31,49.21 | U6.21 164.94,75.72 158.43,75.72 157.32,76.83 157.32,79.69 142.08,79.69 v140.49,78.11 | v139.22,72.71 139.06,72.55 v82.87,72.55
DRAMR/W  (via drill 0.35)
  Top 0.203: U5.29 149.54,52.39 149.54,55.4 149.7,55.56 149.7,60.48 148.59,61.59 U6.29 149.54,72.71 149.54,76.36 149.7,76.52 v149.7,89.53 | CONN1.39 5.24,22.86 5.24,22.38 6.03,21.59 7.78,21.59 7.78,19.84 8.41,19.21 12.7,19.21 12.7,28.1 v16.99,32.38 | v23.5,35.24 24.92,36.67 24.92,46.04 26.04,47.15 30.16,47.15 v30.16,53.02 | v67.94,87.31 66.67,86.04 66.67,69.06 64.93,67.31 64.93,58.9 CONN2.39
  Bottom 0.203: v16.99,32.38 19.84,35.24 v23.5,35.24 | v30.16,53.02 30.32,53.18 38.1,53.18 42.07,57.15 CONN2.39 | v149.7,89.53 148.27,90.96 135.89,90.96 134.3,92.55 73.18,92.55 v67.94,87.31
ECAS  (via drill 0.35)
  Top 0.203: U2.11 8.25,45.08 8.25,71.12 R1.2 | U4.4 52.55,89.38 v52.55,81.6
  Bottom 0.203: v52.55,81.6 51.44,80.49 44.93,80.49 40.96,76.52 28.1,76.52 25.88,74.3 5.08,74.3 R1.2
ECAS'
  Top 0.203: C13.1 R1.1
  Bottom 0.203: U4.11 55.72,84.93 39.53,84.93 37.78,83.19 37.78,76.99 21.75,76.99 C13.1
ERAS  (via drill 0.35)
  Top 0.203: U1.11 30.96,44.93 v30.96,49.05 | v60.8,50.8 60.48,51.12 60.48,95.41 55.72,100.17 52.86,100.17 52.86,98.27 U4.2
  Bottom 0.203: v30.96,49.05 31.91,50.01 47.15,50.01 48.26,51.12 60.48,51.12 v60.8,50.8
GND  (via drill 0.35)
  Top 0.635: CONN1.19 CONN1.20 CONN1.18 | CONN1.19 CONN1.17 | CONN1.29 CONN1.31 | CONN1.19 29.05,22.7 26.83,22.7 CONN1.21 CONN1.23 CONN1.25 CONN1.27 19.05,38.1 | 19.05,38.1 U1.10 | C4.1 50.8,110.49 v50.8,110.97 | CONN2.18 CONN2.20 CONN2.19 CONN2.17 | CONN2.29 CONN2.31 73.98,60.01 73.98,78.74 | 38.89,82.07 37.94,81.12 37.94,79.53 34.13,75.72 25.56,75.72 C13.2 20.32,70.48 C1.1 20.16,69.69 20.16,68.74 16.51,65.09 16.51,38.1 19.05,38.1 | 38.89,82.07 U7.10 | v73.98,79.22 73.98,78.74 | C7.1 38.73,109.85 38.73,82.23 38.89,82.07 | C12.1 129.86,9.84 129.86,3.02 130.49,2.38 165.89,2.38 165.89,4.76 U12.14 166.05,5.4 166.05,4.92 168.43,2.54 U3.12 174.62,4.45 174.62,5.71 173.99,6.35 168.28,6.35 C3.1 169.7,26.83 169.7,30 v172.4,32.7 | 132.08,77.47 v131.13,76.52 131.29,76.36 v131.29,61.59 | 132.08,77.47 136.21,77.47 v136.21,80.96 | CONN3.5 CONN3.7 CONN3.9 CONN3.10 CONN3.8 CONN3.6 v122.55,105.57 | C10.1 137.95,104.62 137.95,121.44 C11.1 | 132.08,77.47 131.44,78.11 v131.44,102.71 | U5.24 161.93,52.07 161.93,54.61 162.56,55.24 162.56,64.14 163.04,64.61 163.04,69.53 161.29,71.28 U6.24 | 182.56,66.67 182.56,73.98 v180.82,75.72 180.98,75.88 180.98,116.2 U11.14 | 182.56,66.67 182.56,59.37 v182.4,59.21 183.04,58.58 183.04,36.83 v182.4,36.2 | v182.4,66.67 182.56,66.67 | 73.98,78.74 110.33,78.74 v110.33,76.52
  Bottom 0.635: U2.10 6.35,39.37 16.99,39.37 18.26,40.64 U1.10 | CONN1.27 CONN1.29 | v50.8,110.97 50.16,111.6 43.34,111.6 C7.1 | CONN2.29 CONN2.27 CONN2.25 CONN2.23 CONN2.21 CONN2.19 | U7.10 45.72,83.82 46.99,82.55 53.34,82.55 53.5,82.71 | U4.7 53.5,82.71 | C2.1 7.78,71.28 18.89,71.28 C1.1 | v73.98,79.22 70.64,82.55 53.66,82.55 53.5,82.71 | U5.16 175.58,32.7 v172.4,32.7 | C5.1 136.37,40.8 145.1,40.8 145.57,41.27 164.15,41.27 164.94,40.48 177.17,40.48 178.91,38.73 178.91,36.35 U5.16 | v131.13,76.52 126.05,76.52 U8.10 125.57,76.36 110.49,76.36 v110.33,76.52 | v136.21,80.96 137.8,82.55 C9.1 | v131.29,61.59 C6.1 | 122.55,105.41 120.49,105.41 120.02,104.93 120.02,102.71 v131.44,102.71 139.54,102.71 C10.1 | 122.55,105.41 C8.1 | v122.55,105.57 122.55,105.41 | U6.16 180.98,58.42 181.61,58.42 v182.4,59.21 | v180.82,75.72 U9.14 178.91,77.63 177.8,77.63 177.8,93.98 178.44,94.61 179.07,94.61 U10.14 | U6.24 163.2,73.66 164.47,73.66 165.1,73.03 165.1,66.67 v182.4,66.67 | C11.1 140.97,121.92 177.48,121.92 179.07,120.33 U11.14 | v182.4,36.2 U5.16
MA0  (via drill 0.35)
  Top 0.203: CONN1.15 35.08,23.65 35.08,27.3 33.97,28.42 22.7,28.42 22.7,50.8 23.02,51.12 v23.02,60.64 23.02,64.77 v23.65,65.41 | CONN2.15 98.58,58.58 v98.58,63.02
  Bottom 0.203: U2.2 6.19,62.07 14.29,62.07 15.4,60.96 U1.2 22.7,60.96 v23.02,60.64 | v98.58,63.02 98.27,62.71 65.56,62.71 63.66,64.61 47.31,64.61 46.99,64.29 32.23,64.29 31.12,65.41 v23.65,65.41
MA1  (via drill 0.35)
  Top 0.203: v67.94,58.1 66.67,59.37 v66.67,65.88
  Bottom 0.203: U1.3 18.89,58.42 17.78,59.53 6.19,59.53 U2.3 3.33,58.42 | CONN1.13 38.26,21.43 38.26,19.21 33.81,19.21 33.02,20 33.02,21.59 18.73,21.59 17.62,20.48 17.62,19.05 3.49,19.05 2.54,20 2.54,58.42 3.33,58.42 | CONN2.13 98.42,58.42 68.26,58.42 v67.94,58.1 | v66.67,65.88 66.36,66.2 5.71,66.2 3.33,63.82 3.33,58.42
MA2  (via drill 0.35)
  Top 0.203: CONN1.3 48.58,23.81 v48.58,33.18 | v18.1,39.05 17.3,39.85 17.3,54.13 U1.4 20.8,57.63 20.8,60.33 v22.23,61.75 | CONN2.3 110.33,59.21 v110.33,62.07
  Bottom 0.203: U2.4 6.19,56.99 17.78,56.99 18.89,55.88 U1.4 | v48.58,33.18 48.26,32.86 46.67,32.86 40.48,39.05 v18.1,39.05 | v110.33,62.07 110.01,61.75 64.29,61.75 63.18,62.86 28.26,62.86 27.78,62.39 22.86,62.39 v22.23,61.75
MA3  (via drill 0.35)
  Top 0.203: v6.98,37.47 6.83,37.62 6.83,51.59 U2.5 | CONN2.1 114.3,57.78 v114.3,62.86 | v50.48,55.72 v58.42,63.66 | v46.83,32.07 v46.83,54.93
  Bottom 0.203: U2.5 6.19,54.45 17.78,54.45 18.89,53.34 U1.5 | CONN1.1 52.07,32.38 46.83,32.38 | 46.83,32.38 45.4,32.38 40.32,37.47 v6.98,37.47 | v114.3,62.86 102.39,62.86 101.76,62.23 64.45,62.23 63.02,63.66 v58.42,63.66 | v50.48,55.72 49.69,54.93 v46.83,54.93 | 46.83,32.38 v46.83,32.07
MA4  (via drill 0.35)
  Top 0.203: CONN1.11 39.05,23.18 v39.05,25.88 | v6.98,30.8 3.33,34.45 3.33,49.05 | U2.6 3.33,49.05 | CONN2.11 101.44,57.94 v101.44,63.02 | v65.88,63.66 65.72,63.82 v65.72,66.99 | v5.4,66.83 3.33,64.77 3.33,49.05
  Bottom 0.203: U2.6 6.19,51.91 17.78,51.91 18.89,50.8 U1.6 | v39.05,25.88 34.13,30.8 v6.98,30.8 | v101.44,63.02 100.65,63.82 97.63,63.82 97.47,63.66 v65.88,63.66 | v65.72,66.99 65.56,66.83 v5.4,66.83
MA5  (via drill 0.35)
  Top 0.203: CONN1.9 40.96,23.81 v40.96,25.08 | v21.91,30 21.27,30.64 21.27,46.04 U1.7 | CONN2.9 104.46,57.47 v104.46,65.56 | v10.48,49.69 v10.48,67.63
  Bottom 0.203: U2.7 6.19,49.37 10.48,49.37 | 10.48,49.37 17.94,49.37 U1.7 | v40.96,25.08 38.73,25.08 33.81,30 v21.91,30 | v104.46,65.56 104.14,65.25 97.79,65.25 97.16,64.61 69.22,64.61 66.04,67.79 65.25,67.79 64.77,67.31 10.79,67.31 v10.48,67.63 | 10.48,49.37 v10.48,49.69
MA6  (via drill 0.35)
  Top 0.203: v33.02,24.29 20.16,24.29 20.16,39.53 20.8,40.16 20.8,43.97 U1.8 | CONN2.7 105.89,55.72 105.89,53.34 104.62,52.07 v104.62,48.42 | v46.04,47.78 45.56,47.31 45.56,23.97 CONN1.7
  Bottom 0.203: U2.8 6.19,46.83 17.78,46.83 18.89,45.72 U1.8 | CONN1.7 43.02,24.29 v33.02,24.29 | v104.62,48.42 80.49,48.42 79.22,49.69 76.2,49.69 75.56,49.05 55.4,49.05 54.29,50.16 48.42,50.16 v46.04,47.78
MA7  (via drill 0.35)
  Top 0.203: CONN1.5 47.62,23.49 v47.62,33.66 47.47,33.81 47.47,48.1 47.62,48.26 47.62,56.83 44.61,56.83 43.66,57.78 43.66,62.07 v46.67,65.09 | CONN2.5 109.54,57.47 v109.54,63.66
  Bottom 0.203: U2.9 6.19,42.07 17.94,42.07 | U1.9 17.94,42.07 | v47.62,33.66 39.21,42.07 17.94,42.07 | v109.54,63.66 108.9,64.29 97.47,64.29 97.31,64.14 66.52,64.14 65.56,65.09 v46.67,65.09
MD0  (via drill 0.35)
  Top 0.203: U9.11 172.09,78.11 172.09,91.28 172.56,91.76 172.56,96.52 171.45,97.63 U10.11 171.45,97.95 172.56,99.06 172.56,108.11 | U11.11 172.4,117.16 172.4,114.14 172.56,113.98 172.56,108.11 | U12.11 157.48,6.35 v157.48,17.94 | v152.72,23.18 153.51,23.97 v153.51,33.97 | v154.94,45.08 v154.94,38.73 | v114.78,46.36 111.28,42.86 88.74,42.86 88.74,51.12 88.9,51.28 88.9,53.66 88.27,54.29 88.27,57.47 86.2,59.53 83.66,59.53 v83.66,76.68 | v72.87,82.55 69.37,86.04 69.37,99.69 67.94,101.12 v67.94,115.25 | v171.61,108.11 172.56,108.11
  Bottom 0.203: v157.48,17.94 156.69,18.73 153.19,18.73 151.92,20 151.92,23.18 v152.72,23.18 | v153.51,33.97 154.94,35.4 v154.94,38.73 | v154.94,45.08 154.31,45.72 152.88,45.72 152.72,45.88 148.43,45.88 148.11,45.56 143.19,45.56 142.88,45.88 137.16,45.88 136.37,45.08 127.95,45.08 126.84,46.2 118.43,46.2 118.27,46.36 v114.78,46.36 | v83.66,76.68 77.79,82.55 v72.87,82.55 | v67.94,115.25 68.1,115.41 74.77,115.41 75.72,114.46 75.72,110.97 76.04,110.97 76.36,110.65 83.34,110.65 CONN3.36 85.72,110.49 120.33,110.49 120.65,110.81 121.92,110.81 123.51,109.22 140.18,109.22 141.29,108.11 v171.61,108.11
MD1  (via drill 0.35)
  Top 0.203: U12.12 159.23,7.14 159.23,28.1 158.59,28.73 v158.59,33.97 | v160.18,37.94 160.5,38.26 v160.5,46.2 | v171.61,46.83 172.56,47.78 v172.56,49.69 | v178.12,60.33 178.12,70.64 177.64,71.12 v177.64,73.82 | U11.12 173.99,117.95 175.1,116.84 175.1,112.08 174.94,111.92 174.94,98.74 U10.12 173.99,97.63 175.1,96.52 175.1,91.76 174.94,91.6 174.94,78.42 U9.12 | CONN3.34 85.88,112.87 v85.88,115.41
  Bottom 0.203: v158.59,33.97 160.18,35.56 v160.18,37.94 | v160.5,46.2 161.13,46.83 v171.61,46.83 | v172.56,49.69 172.56,60.33 v178.12,60.33 | U9.12 v177.64,73.82 | v85.88,115.41 86.36,115.89 128.27,115.89 132.87,111.28 164.15,111.28 165.26,112.39 165.26,116.36 172.24,116.36 U11.12
MD2  (via drill 0.35)
  Top 0.203: v174.47,9.05 177.96,12.54 177.96,39.05 181.29,42.39 181.29,55.24 180.66,55.88 180.66,58.42 180.02,59.05 180.02,70.64 180.18,70.8 v180.18,73.82 | U11.13 177.64,117 177.64,112.08 177.48,111.92 177.48,98.74 U10.13 176.53,97.47 177.64,96.36 177.64,78.58 U9.13 | CONN3.32 91.28,110.01 106.84,110.01 106.84,105.89 v110.65,102.08
  Bottom 0.203: U12.13 166.53,9.05 v174.47,9.05 | U9.13 v180.18,73.82 | v110.65,102.08 112.55,100.17 134.94,100.17 135.25,99.85 174.47,99.85 U10.13
MD3  (via drill 0.35)
  Top 0.203: U9.15 178.12,93.66 178.12,96.52 177.96,96.68 177.96,111.76 179.07,112.87 U10.15 | U12.15 166.05,21.27 v166.05,33.5 | v163.99,33.97 162.72,35.24 162.72,38.26 163.04,38.58 v163.04,44.29 | v126.36,44.93 125.41,45.88 v125.41,57.78 | v119.54,58.1 119.38,58.26 119.38,81.12 118.74,81.76 118.74,92.71 116.84,94.61 116.84,103.19 108.43,111.6 108.43,112.24 | 108.43,112.24 107.47,113.19 92.07,113.19 CONN3.29 | v116.2,122.24 108.43,114.46 108.43,112.24
  Bottom 0.203: U11.15 179.07,121.28 180.18,120.17 180.18,116.36 | 180.18,116.36 180.18,113.03 U10.15 | v166.05,33.5 165.58,33.97 v163.99,33.97 | v163.04,44.29 150.34,44.29 150.02,44.61 143.19,44.61 142.4,43.81 127.48,43.81 v126.36,44.93 | v125.41,57.78 125.09,58.1 v119.54,58.1 | 180.18,116.36 178.59,116.36 177.64,117.32 177.64,120.81 154.15,120.81 153.83,121.13 133.19,121.13 132.08,122.24 v116.2,122.24
MD4  (via drill 0.35)
  Top 0.203: U12.16 164.47,22.22 164.47,28.42 164.78,28.73 164.78,31.75 v164.47,32.07 | v176.69,39.53 177.64,40.48 v177.64,54.61 | v176.85,59.37 175.58,60.64 175.58,70.64 175.42,70.8 175.42,91.44 176.53,92.55 U9.16 175.58,93.66 175.58,96.68 175.42,96.84 175.42,111.76 176.53,112.87 U10.16 175.58,113.98 175.58,117 175.42,117.16 175.42,132.24 U11.16 | v95.73,120.49 CONN3.31
  Bottom 0.203: v164.47,32.07 165.1,32.7 170.02,32.7 172.88,35.56 172.88,39.53 v176.69,39.53 | v177.64,54.61 177.64,59.37 v176.85,59.37 | v95.73,120.49 153.83,120.49 154.46,119.86 174.31,119.86 175.42,118.74 175.42,113.03 U10.16
MD5  (via drill 0.35)
  Top 0.203: U12.17 159.7,21.91 159.7,28.26 159.39,28.57 159.39,34.77 159.86,35.24 159.86,37.15 159.39,37.62 v159.39,46.2 | v178.91,53.82 178.44,54.29 178.44,54.93 177.64,55.72 177.64,59.69 176.69,60.64 v176.69,69.53 | U11.17 172.88,132.24 172.88,117.16 173.04,117 173.04,113.98 U10.17 173.99,99.85 172.88,98.74 172.88,96.84 173.04,96.68 173.04,93.66 U9.17 | v91.12,118.43 CONN3.33 | v141.13,118.43 146.69,123.98 v146.69,125.89
  Bottom 0.203: v159.39,46.2 160.81,47.62 178.44,47.62 180.18,49.37 180.18,53.82 v178.91,53.82 | v176.69,69.53 175.1,71.12 175.1,75.72 173.67,75.72 172.88,76.52 172.88,85.88 173.2,85.88 173.99,86.68 U9.17 | v141.13,118.43 v91.12,118.43 | v146.69,125.89 149.7,128.91 169.55,128.91 U11.17
MD6  (via drill 0.35)
  Top 0.203: U11.18 170.34,132.24 170.34,117.16 170.5,117 170.5,113.98 U10.18 170.66,112.24 170.66,99.06 170.34,98.74 170.34,93.98 171.45,92.87 U9.18 171.45,88.9 v170.02,87.47 | U12.18 157.48,20.32 157.48,19.05 v156.37,17.94 | v131.44,22.54 130.65,23.34 130.65,42.39 130.33,42.7 130.33,44.93 130.97,45.56 130.97,53.18 130.18,53.97 130.18,57.47 v132.87,60.17 | v134.46,60.64 134.62,60.8 134.62,63.66 137.48,66.52 137.48,83.66 v137.16,83.98 | CONN3.35 85.09,114.94 85.09,115.73 v87.15,117.79 | v141.92,117.79 143.67,116.05 v143.67,86.36
  Bottom 0.203: v156.37,17.94 156.05,18.26 133.19,18.26 131.44,20 v131.44,22.54 | v132.87,60.17 133.35,60.64 v134.46,60.64 | v137.16,83.98 139.54,86.36 v143.67,86.36 146.37,86.36 147.48,87.47 v170.02,87.47 | v87.15,117.79 87.31,117.63 141.76,117.63 v141.92,117.79
MD7  (via drill 0.35)
  Top 0.203: U12.19 156.05,21.43 v156.05,33.97 | v162.08,38.73 162.24,38.89 162.24,49.53 v162.4,49.69 | v167.48,59.85 167.64,60.01 v167.64,67.63 | v170.02,75.72 v170.02,70.01 | U11.19 167.8,132.24 167.8,117.16 167.96,117 167.96,113.98 U10.19 168.91,101.12 167.8,100.01 167.8,96.84 167.96,96.68 167.96,93.66 U9.19 | CONN3.38 83.34,113.19 83.34,116.05 v90.96,123.67 | v143.83,129.38 v138.11,123.67
  Bottom 0.203: v156.05,33.97 157.64,35.56 157.64,38.73 v162.08,38.73 | v162.4,49.69 162.4,53.82 165.74,53.82 167.48,55.56 v167.48,59.85 | v170.02,70.01 v167.64,67.63 | v170.02,75.72 170.02,78.42 170.34,78.42 170.81,78.9 170.81,88.11 170.34,88.11 168.28,90.17 168.28,92.71 U9.19 | v138.11,123.67 v90.96,123.67 | v143.83,129.38 164.94,129.38 U11.19
PHI1  (via drill 0.35)
  Top 0.203: v145.73,25.24 144.3,26.67 v144.3,33.18 | v142.24,34.61 142.08,34.77 142.08,37.15 140.65,38.58 140.65,49.53 139.86,50.32 139.86,53.34 142.4,55.88 v142.4,66.04 | v153.03,67.47 153.03,70.33 152.24,71.12 v152.24,80.49 | v147.8,80.96 147,81.76 147,91.44 147.16,91.6 147.16,93.82 v145.42,95.57 | v140.65,99.06 134.46,105.25 134.46,115.25 v130.02,119.7 | v100.65,119.7 95.57,119.7 95.57,116.2 94.61,115.25 CONN3.27
  Bottom 0.203: U3.5 168.91,24.13 163.04,24.13 161.77,25.4 145.89,25.4 v145.73,25.24 | v144.3,33.18 142.88,34.61 v142.24,34.61 | v142.4,66.04 142.56,66.2 148.11,66.2 149.38,67.47 v153.03,67.47 | v152.24,80.49 151.77,80.96 v147.8,80.96 | v145.42,95.57 141.92,99.06 v140.65,99.06 | v100.65,119.7 v130.02,119.7
R/W  (via drill 0.35)
  Top 0.203: v67.47,85.72 69.22,83.98 CONN2.37 68.1,56.04 68.1,53.5 66.2,53.5 65.56,54.13 65.56,54.29 v63.66,56.2 | v40.64,36.04 45.09,40.48 45.09,54.29 v46.83,56.04 | 147.48,130.97 147.48,132.24 U11.27 | 147.48,130.97 147.48,114.14 U10.27 147.48,111.92 147.48,94.14 148.59,93.03 U9.27 147.8,91.92 v147.8,86.68 | v149.23,22.54 150.02,23.34 v150.02,37.94 | v156.84,39.21 156.84,49.21 v157.32,49.69 | v165.26,59.85 165.1,60.01 165.1,74.14 162.4,76.83 v162.4,84.3 | v123.35,86.84 122.71,87.47 122.71,104.62 123.51,105.41 123.51,108.58 126.36,111.44 126.36,117.16 134.78,125.57 139.38,125.57 139.38,126.05 144.3,130.97 147.48,130.97
  Bottom 0.203: U4.9 62.87,85.72 v67.47,85.72 122.24,85.72 v123.35,86.84 | CONN1.37 6.35,29.69 5.71,30.32 5.71,36.04 v40.64,36.04 | v46.83,56.04 47.31,56.52 63.34,56.52 v63.66,56.2 | U12.27 137,22.7 149.07,22.7 v149.23,22.54 | v150.02,37.94 150.5,38.42 153.51,38.42 154.62,39.53 156.53,39.53 v156.84,39.21 | v157.32,49.69 157.32,54.29 163.67,54.29 165.26,55.88 v165.26,59.85 | v162.4,84.3 160.02,86.68 v147.8,86.68
SA0  (via drill 0.35)
  Top 0.203: U5.12 168.12,36.99 168.12,50.16 167.8,50.48 167.8,55.4 U6.12 | U7.11 v48.26,61.59 | v34.45,43.02 31.75,45.72 31.75,55.88 U1.19
  Bottom 0.203: U1.19 27.62,61.91 40.01,61.91 40.64,61.28 47.94,61.28 v48.26,61.59 | U5.12 165.74,39.37 162.56,39.37 161.93,40 145.89,40 145.42,39.53 129.38,39.53 125.89,43.02 v34.45,43.02
SA1  (via drill 0.35)
  Top 0.203: U5.11 166.05,36.51 166.05,49.69 165.26,50.48 165.26,55.24 166.37,56.36 U6.11 168.43,58.58 168.43,70.17 167.8,70.8 167.8,87.47 168.28,87.95 168.28,88.58 v166.69,90.17 | U1.18 24.92,60.17 24.92,61.28 26.04,62.39 32.7,62.39 32.7,70.48 v41.75,79.53 | v50.48,81.6 50.48,84.3 48.42,86.36 U7.12 | v142.88,88.11 142.08,88.9 142.08,98.74 134.94,105.89 134.94,117.95 v131.6,121.28 | v59.37,121.28 50.01,111.92 50.01,106.2 49.05,105.25 44.77,105.25 v44.77,88.42
  Bottom 0.203: v41.75,79.53 43.81,81.6 v50.48,81.6 | v166.69,90.17 164.62,88.11 v142.88,88.11 | v59.37,121.28 v131.6,121.28 | v44.77,88.42 46.83,86.36 U7.12
SA2  (via drill 0.35)
  Top 0.203: U5.10 v163.83,40.16 163.83,49.37 162.72,50.48 162.72,54.45 163.83,55.56 U6.10 | v44.45,58.1 47.47,61.12 47.47,82.55 46.04,83.98 46.04,86.84 48.1,88.9 U7.13 | v67.79,43.81 61.59,50.01 v61.59,57.94
  Bottom 0.203: U1.17 39.69,55.88 41.91,58.1 v44.45,58.1 61.44,58.1 v61.59,57.94 | v163.83,40.16 163.51,40.48 145.73,40.48 145.26,40 129.54,40 125.73,43.81 v67.79,43.81
SA3  (via drill 0.35)
  Top 0.203: U5.9 161.29,49.21 160.18,50.32 160.18,55.24 161.29,56.36 U6.9 160.66,57.15 v160.66,59.53 | v32.54,53.97 33.18,54.61 v33.18,60.64 33.18,69.85 42.55,79.22 v42.55,87.31
  Bottom 0.203: U1.16 27.3,53.97 v32.54,53.97 | v42.55,87.31 46.67,91.44 U7.14 | v160.66,59.53 157.64,62.55 150.02,62.55 149.38,63.18 134.14,63.18 133.35,62.39 130.33,62.39 128.27,60.33 33.5,60.33 v33.18,60.64
SA4  (via drill 0.35)
  Top 0.203: U5.8 158.43,36.51 158.43,49.69 157.64,50.48 157.64,55.24 158.75,56.36 U6.8 | v41.27,50.8 43.18,52.7 v43.18,71.91 43.18,81.44 45.56,83.82 45.56,91.28 U7.15 | v124.46,65.56 v126.52,63.5 | v78.26,71.91 v82.07,68.1
  Bottom 0.203: v41.27,50.8 U1.15 | U6.8 161.45,59.21 161.45,63.98 151.45,63.98 151.29,64.14 133.83,64.14 133.19,63.5 v126.52,63.5 | v124.46,65.56 123.51,66.52 115.41,66.52 113.51,68.42 105.89,68.42 105.57,68.1 v82.07,68.1 | v43.18,71.91 v78.26,71.91
SA5  (via drill 0.35)
  Top 0.203: U5.7 156.05,36.35 156.05,49.53 155.1,50.48 155.1,55.24 156.21,56.36 U6.7 155.42,57.31 v155.42,69.53 | U1.14 24.45,50.48 24.45,69.06 24.13,69.37 24.13,70.33 v28.58,74.77 | v50.48,74.93 51.28,75.72 v51.28,94.46 | v92.71,74.77 v96.68,70.8